# EAGLE design BackPlane (EAGLE 7.4.0)
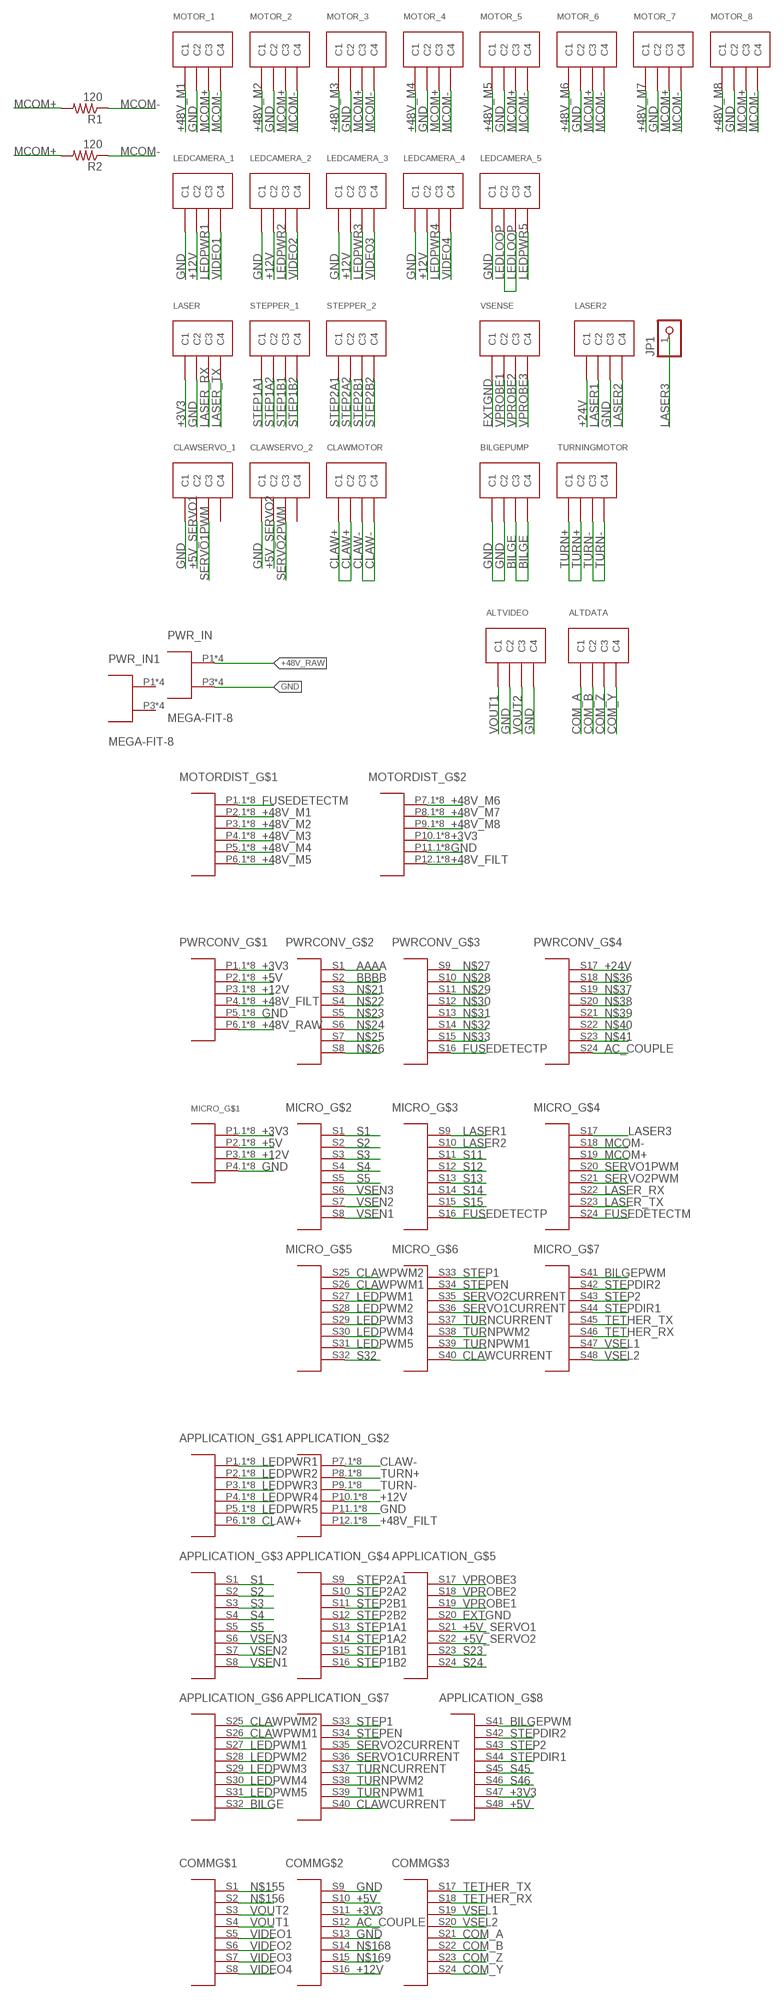
[diagram p0: schematic, sheet 1]

## Parts
ALTDATA  MICRO-FIT-4-SMD-PART  [MIRCO-FIT-4-SMD]
ALTVIDEO  MICRO-FIT-4-SMD-PART  [MIRCO-FIT-4-SMD]
APPLICATION_  TEN60-P6-S24-S24-P6-VERT  [TEN60-P6-S24-S24-P6-VERT]
BILGEPUMP  MICRO-FIT-4-SMD-PART  [MIRCO-FIT-4-SMD]
CLAWMOTOR  MICRO-FIT-4-SMD-PART  [MIRCO-FIT-4-SMD]
CLAWSERVO_1  MICRO-FIT-4-SMD-PART  [MIRCO-FIT-4-SMD]
CLAWSERVO_2  MICRO-FIT-4-SMD-PART  [MIRCO-FIT-4-SMD]
COMM  TEN60-S24-RA  [TEN60-S24-RA]
JP1  PINHD-1X1  [1X01]
LASER  MICRO-FIT-4-SMD-PART  [MIRCO-FIT-4-SMD]
LASER2  MICRO-FIT-4-SMD-PART  [MIRCO-FIT-4-SMD]
LEDCAMERA_1  MICRO-FIT-4-SMD-PART  [MIRCO-FIT-4-SMD]
LEDCAMERA_2  MICRO-FIT-4-SMD-PART  [MIRCO-FIT-4-SMD]
LEDCAMERA_3  MICRO-FIT-4-SMD-PART  [MIRCO-FIT-4-SMD]
LEDCAMERA_4  MICRO-FIT-4-SMD-PART  [MIRCO-FIT-4-SMD]
LEDCAMERA_5  MICRO-FIT-4-SMD-PART  [MIRCO-FIT-4-SMD]
MICRO_  TEN60-S24-S24-P4-VERT  [TEN60-S24-S24-P4-VERT]
MOTOR_1  MICRO-FIT-4-SMD-PART  [MIRCO-FIT-4-SMD]
MOTOR_2  MICRO-FIT-4-SMD-PART  [MIRCO-FIT-4-SMD]
MOTOR_3  MICRO-FIT-4-SMD-PART  [MIRCO-FIT-4-SMD]
MOTOR_4  MICRO-FIT-4-SMD-PART  [MIRCO-FIT-4-SMD]
MOTOR_5  MICRO-FIT-4-SMD-PART  [MIRCO-FIT-4-SMD]
MOTOR_6  MICRO-FIT-4-SMD-PART  [MIRCO-FIT-4-SMD]
MOTOR_7  MICRO-FIT-4-SMD-PART  [MIRCO-FIT-4-SMD]
MOTOR_8  MICRO-FIT-4-SMD-PART  [MIRCO-FIT-4-SMD]
MOTORDIST_  TEN60-P6-P6-VERT  [TEN60-P6-P6-VERT]
PWR_IN  MEGA-FIT-8  [MEGA-FIT-8]
PWR_IN1  MEGA-FIT-8  [MEGA-FIT-8]
PWRCONV_  TEN60-S24-P6-VERT  [TEN60-S24-P6-VERT]
R1  120  R-US_R0603  [R0603]
R2  120  R-US_R0603  [R0603]
STEPPER_1  MICRO-FIT-4-SMD-PART  [MIRCO-FIT-4-SMD]
STEPPER_2  MICRO-FIT-4-SMD-PART  [MIRCO-FIT-4-SMD]
TURNINGMOTOR  MICRO-FIT-4-SMD-PART  [MIRCO-FIT-4-SMD]
VSENSE  MICRO-FIT-4-SMD-PART  [MIRCO-FIT-4-SMD]

## Nets
+3V3: APPLICATION_.S47 COMM.S11 LASER.C1 MICRO_.P1.1 MICRO_.P1.2 MICRO_.P1.3 MICRO_.P1.4 MICRO_.P1.5 MICRO_.P1.6 MICRO_.P1.7 MICRO_.P1.8 MOTORDIST_.P10.1 MOTORDIST_.P10.2 MOTORDIST_.P10.3 MOTORDIST_.P10.4 MOTORDIST_.P10.5 MOTORDIST_.P10.6 MOTORDIST_.P10.7 MOTORDIST_.P10.8 PWRCONV_.P1.1 PWRCONV_.P1.2 PWRCONV_.P1.3 PWRCONV_.P1.4 PWRCONV_.P1.5 PWRCONV_.P1.6 PWRCONV_.P1.7 PWRCONV_.P1.8
+5V: APPLICATION_.S48 COMM.S10 MICRO_.P2.1 MICRO_.P2.2 MICRO_.P2.3 MICRO_.P2.4 MICRO_.P2.5 MICRO_.P2.6 MICRO_.P2.7 MICRO_.P2.8 PWRCONV_.P2.1 PWRCONV_.P2.2 PWRCONV_.P2.3 PWRCONV_.P2.4 PWRCONV_.P2.5 PWRCONV_.P2.6 PWRCONV_.P2.7 PWRCONV_.P2.8
+5V_SERVO1: APPLICATION_.S21 CLAWSERVO_1.C2
+5V_SERVO2: APPLICATION_.S22 CLAWSERVO_2.C2
+12V: APPLICATION_.P10.1 APPLICATION_.P10.2 APPLICATION_.P10.3 APPLICATION_.P10.4 APPLICATION_.P10.5 APPLICATION_.P10.6 APPLICATION_.P10.7 APPLICATION_.P10.8 COMM.S16 LEDCAMERA_1.C2 LEDCAMERA_2.C2 LEDCAMERA_3.C2 LEDCAMERA_4.C2 MICRO_.P3.1 MICRO_.P3.2 MICRO_.P3.3 MICRO_.P3.4 MICRO_.P3.5 MICRO_.P3.6 MICRO_.P3.7 MICRO_.P3.8 PWRCONV_.P3.1 PWRCONV_.P3.2 PWRCONV_.P3.3 PWRCONV_.P3.4 PWRCONV_.P3.5 PWRCONV_.P3.6 PWRCONV_.P3.7 PWRCONV_.P3.8
+24V: LASER2.C1 PWRCONV_.S17
+48V_FILT: APPLICATION_.P12.1 APPLICATION_.P12.2 APPLICATION_.P12.3 APPLICATION_.P12.4 APPLICATION_.P12.5 APPLICATION_.P12.6 APPLICATION_.P12.7 APPLICATION_.P12.8 MOTORDIST_.P12.1 MOTORDIST_.P12.2 MOTORDIST_.P12.3 MOTORDIST_.P12.4 MOTORDIST_.P12.5 MOTORDIST_.P12.6 MOTORDIST_.P12.7 MOTORDIST_.P12.8 PWRCONV_.P4.1 PWRCONV_.P4.2 PWRCONV_.P4.3 PWRCONV_.P4.4 PWRCONV_.P4.5 PWRCONV_.P4.6 PWRCONV_.P4.7 PWRCONV_.P4.8
+48V_M1: MOTOR_1.C1 MOTORDIST_.P2.1 MOTORDIST_.P2.2 MOTORDIST_.P2.3 MOTORDIST_.P2.4 MOTORDIST_.P2.5 MOTORDIST_.P2.6 MOTORDIST_.P2.7 MOTORDIST_.P2.8
+48V_M2: MOTOR_2.C1 MOTORDIST_.P3.1 MOTORDIST_.P3.2 MOTORDIST_.P3.3 MOTORDIST_.P3.4 MOTORDIST_.P3.5 MOTORDIST_.P3.6 MOTORDIST_.P3.7 MOTORDIST_.P3.8
+48V_M3: MOTOR_3.C1 MOTORDIST_.P4.1 MOTORDIST_.P4.2 MOTORDIST_.P4.3 MOTORDIST_.P4.4 MOTORDIST_.P4.5 MOTORDIST_.P4.6 MOTORDIST_.P4.7 MOTORDIST_.P4.8
+48V_M4: MOTOR_4.C1 MOTORDIST_.P5.1 MOTORDIST_.P5.2 MOTORDIST_.P5.3 MOTORDIST_.P5.4 MOTORDIST_.P5.5 MOTORDIST_.P5.6 MOTORDIST_.P5.7 MOTORDIST_.P5.8
+48V_M5: MOTOR_5.C1 MOTORDIST_.P6.1 MOTORDIST_.P6.2 MOTORDIST_.P6.3 MOTORDIST_.P6.4 MOTORDIST_.P6.5 MOTORDIST_.P6.6 MOTORDIST_.P6.7 MOTORDIST_.P6.8
+48V_M6: MOTOR_6.C1 MOTORDIST_.P7.1 MOTORDIST_.P7.2 MOTORDIST_.P7.3 MOTORDIST_.P7.4 MOTORDIST_.P7.5 MOTORDIST_.P7.6 MOTORDIST_.P7.7 MOTORDIST_.P7.8
+48V_M7: MOTOR_7.C1 MOTORDIST_.P8.1 MOTORDIST_.P8.2 MOTORDIST_.P8.3 MOTORDIST_.P8.4 MOTORDIST_.P8.5 MOTORDIST_.P8.6 MOTORDIST_.P8.7 MOTORDIST_.P8.8
+48V_M8: MOTOR_8.C1 MOTORDIST_.P9.1 MOTORDIST_.P9.2 MOTORDIST_.P9.3 MOTORDIST_.P9.4 MOTORDIST_.P9.5 MOTORDIST_.P9.6 MOTORDIST_.P9.7 MOTORDIST_.P9.8
+48V_RAW: PWR_IN.P1 PWR_IN.P2 PWR_IN.P5 PWR_IN.P6 PWRCONV_.P6.1 PWRCONV_.P6.2 PWRCONV_.P6.3 PWRCONV_.P6.4 PWRCONV_.P6.5 PWRCONV_.P6.6 PWRCONV_.P6.7 PWRCONV_.P6.8
AAAA: PWRCONV_.S1
AC_COUPLE: COMM.S12 PWRCONV_.S24
BBBB: PWRCONV_.S2
BILGE: APPLICATION_.S32 BILGEPUMP.C3 BILGEPUMP.C4
BILGEPWM: APPLICATION_.S41 MICRO_.S41
CLAW+: APPLICATION_.P6.1 APPLICATION_.P6.2 APPLICATION_.P6.3 APPLICATION_.P6.4 APPLICATION_.P6.5 APPLICATION_.P6.6 APPLICATION_.P6.7 APPLICATION_.P6.8 CLAWMOTOR.C1 CLAWMOTOR.C2
CLAW-: APPLICATION_.P7.1 APPLICATION_.P7.2 APPLICATION_.P7.3 APPLICATION_.P7.4 APPLICATION_.P7.5 APPLICATION_.P7.6 APPLICATION_.P7.7 APPLICATION_.P7.8 CLAWMOTOR.C3 CLAWMOTOR.C4
CLAWCURRENT: APPLICATION_.S40 MICRO_.S40
CLAWPWM1: APPLICATION_.S26 MICRO_.S26
CLAWPWM2: APPLICATION_.S25 MICRO_.S25
COM_A: ALTDATA.C1 COMM.S21
COM_B: ALTDATA.C2 COMM.S22
COM_Y: ALTDATA.C4 COMM.S24
COM_Z: ALTDATA.C3 COMM.S23
EXTGND: APPLICATION_.S20 VSENSE.C1
FUSEDETECTM: MICRO_.S24 MOTORDIST_.P1.1 MOTORDIST_.P1.2 MOTORDIST_.P1.3 MOTORDIST_.P1.4 MOTORDIST_.P1.5 MOTORDIST_.P1.6 MOTORDIST_.P1.7 MOTORDIST_.P1.8
FUSEDETECTP: MICRO_.S16 PWRCONV_.S16
GND: ALTVIDEO.C2 ALTVIDEO.C4 APPLICATION_.P11.1 APPLICATION_.P11.2 APPLICATION_.P11.3 APPLICATION_.P11.4 APPLICATION_.P11.5 APPLICATION_.P11.6 APPLICATION_.P11.7 APPLICATION_.P11.8 BILGEPUMP.C1 BILGEPUMP.C2 CLAWSERVO_1.C1 CLAWSERVO_2.C1 COMM.S9 COMM.S13 LASER2.C3 LASER.C2 LEDCAMERA_1.C1 LEDCAMERA_2.C1 LEDCAMERA_3.C1 LEDCAMERA_4.C1 LEDCAMERA_5.C1 MICRO_.P4.1 MICRO_.P4.2 MICRO_.P4.3 MICRO_.P4.4 MICRO_.P4.5 MICRO_.P4.6 MICRO_.P4.7 MICRO_.P4.8 MOTOR_1.C2 MOTOR_2.C2 MOTOR_3.C2 MOTOR_4.C2 MOTOR_5.C2 MOTOR_6.C2 MOTOR_7.C2 MOTOR_8.C2 MOTORDIST_.P11.1 MOTORDIST_.P11.2 MOTORDIST_.P11.3 MOTORDIST_.P11.4 MOTORDIST_.P11.5 MOTORDIST_.P11.6 MOTORDIST_.P11.7 MOTORDIST_.P11.8 PWR_IN.P3 PWR_IN.P4 PWR_IN.P7 PWR_IN.P8 PWRCONV_.P5.1 PWRCONV_.P5.2 PWRCONV_.P5.3 PWRCONV_.P5.4 PWRCONV_.P5.5 PWRCONV_.P5.6 PWRCONV_.P5.7 PWRCONV_.P5.8
LASER1: LASER2.C2 MICRO_.S9
LASER2: LASER2.C4 MICRO_.S10
LASER3: JP1.1 MICRO_.S17
LASER_RX: LASER.C3 MICRO_.S22
LASER_TX: LASER.C4 MICRO_.S23
LEDLOOP: LEDCAMERA_5.C2 LEDCAMERA_5.C3
LEDPWM1: APPLICATION_.S27 MICRO_.S27
LEDPWM2: APPLICATION_.S28 MICRO_.S28
LEDPWM3: APPLICATION_.S29 MICRO_.S29
LEDPWM4: APPLICATION_.S30 MICRO_.S30
LEDPWM5: APPLICATION_.S31 MICRO_.S31
LEDPWR1: APPLICATION_.P1.1 APPLICATION_.P1.2 APPLICATION_.P1.3 APPLICATION_.P1.4 APPLICATION_.P1.5 APPLICATION_.P1.6 APPLICATION_.P1.7 APPLICATION_.P1.8 LEDCAMERA_1.C3
LEDPWR2: APPLICATION_.P2.1 APPLICATION_.P2.2 APPLICATION_.P2.3 APPLICATION_.P2.4 APPLICATION_.P2.5 APPLICATION_.P2.6 APPLICATION_.P2.7 APPLICATION_.P2.8 LEDCAMERA_2.C3
LEDPWR3: APPLICATION_.P3.1 APPLICATION_.P3.2 APPLICATION_.P3.3 APPLICATION_.P3.4 APPLICATION_.P3.5 APPLICATION_.P3.6 APPLICATION_.P3.7 APPLICATION_.P3.8 LEDCAMERA_3.C3
LEDPWR4: APPLICATION_.P4.1 APPLICATION_.P4.2 APPLICATION_.P4.3 APPLICATION_.P4.4 APPLICATION_.P4.5 APPLICATION_.P4.6 APPLICATION_.P4.7 APPLICATION_.P4.8 LEDCAMERA_4.C3
LEDPWR5: APPLICATION_.P5.1 APPLICATION_.P5.2 APPLICATION_.P5.3 APPLICATION_.P5.4 APPLICATION_.P5.5 APPLICATION_.P5.6 APPLICATION_.P5.7 APPLICATION_.P5.8 LEDCAMERA_5.C4
MCOM+: MICRO_.S19 MOTOR_1.C3 MOTOR_2.C3 MOTOR_3.C3 MOTOR_4.C3 MOTOR_5.C3 MOTOR_6.C3 MOTOR_7.C3 MOTOR_8.C3 R1.2 R2.2
MCOM-: MICRO_.S18 MOTOR_1.C4 MOTOR_2.C4 MOTOR_3.C4 MOTOR_4.C4 MOTOR_5.C4 MOTOR_6.C4 MOTOR_7.C4 MOTOR_8.C4 R1.1 R2.1
N$21: PWRCONV_.S3
N$22: PWRCONV_.S4
N$23: PWRCONV_.S5
N$24: PWRCONV_.S6
N$25: PWRCONV_.S7
N$26: PWRCONV_.S8
N$27: PWRCONV_.S9
N$28: PWRCONV_.S10
N$29: PWRCONV_.S11
N$30: PWRCONV_.S12
N$31: PWRCONV_.S13
N$32: PWRCONV_.S14
N$33: PWRCONV_.S15
N$36: PWRCONV_.S18
N$37: PWRCONV_.S19
N$38: PWRCONV_.S20
N$39: PWRCONV_.S21
N$40: PWRCONV_.S22
N$41: PWRCONV_.S23
N$155: COMM.S1
N$156: COMM.S2
N$168: COMM.S14
N$169: COMM.S15
S1: APPLICATION_.S1 MICRO_.S1
S2: APPLICATION_.S2 MICRO_.S2
S3: APPLICATION_.S3 MICRO_.S3
S4: APPLICATION_.S4 MICRO_.S4
S5: APPLICATION_.S5 MICRO_.S5
S11: MICRO_.S11
S12: MICRO_.S12
S13: MICRO_.S13
S14: MICRO_.S14
S15: MICRO_.S15
S23: APPLICATION_.S23
S24: APPLICATION_.S24
S32: MICRO_.S32
S45: APPLICATION_.S45
S46: APPLICATION_.S46
SERVO1CURRENT: APPLICATION_.S36 MICRO_.S36
SERVO1PWM: CLAWSERVO_1.C3 MICRO_.S20
SERVO2CURRENT: APPLICATION_.S35 MICRO_.S35
SERVO2PWM: CLAWSERVO_2.C3 MICRO_.S21
STEP1: APPLICATION_.S33 MICRO_.S33
STEP1A1: APPLICATION_.S13 STEPPER_1.C1
STEP1A2: APPLICATION_.S14 STEPPER_1.C2
STEP1B1: APPLICATION_.S15 STEPPER_1.C3
STEP1B2: APPLICATION_.S16 STEPPER_1.C4
STEP2: APPLICATION_.S43 MICRO_.S43
STEP2A1: APPLICATION_.S9 STEPPER_2.C1
STEP2A2: APPLICATION_.S10 STEPPER_2.C2
STEP2B1: APPLICATION_.S11 STEPPER_2.C3
STEP2B2: APPLICATION_.S12 STEPPER_2.C4
STEPDIR1: APPLICATION_.S44 MICRO_.S44
STEPDIR2: APPLICATION_.S42 MICRO_.S42
STEPEN: APPLICATION_.S34 MICRO_.S34
TETHER_RX: COMM.S18 MICRO_.S46
TETHER_TX: COMM.S17 MICRO_.S45
TURN+: APPLICATION_.P8.1 APPLICATION_.P8.2 APPLICATION_.P8.3 APPLICATION_.P8.4 APPLICATION_.P8.5 APPLICATION_.P8.6 APPLICATION_.P8.7 APPLICATION_.P8.8 TURNINGMOTOR.C1 TURNINGMOTOR.C2
TURN-: APPLICATION_.P9.1 APPLICATION_.P9.2 APPLICATION_.P9.3 APPLICATION_.P9.4 APPLICATION_.P9.5 APPLICATION_.P9.6 APPLICATION_.P9.7 APPLICATION_.P9.8 TURNINGMOTOR.C3 TURNINGMOTOR.C4
TURNCURRENT: APPLICATION_.S37 MICRO_.S37
TURNPWM1: APPLICATION_.S39 MICRO_.S39
TURNPWM2: APPLICATION_.S38 MICRO_.S38
VIDEO1: COMM.S5 LEDCAMERA_1.C4
VIDEO2: COMM.S6 LEDCAMERA_2.C4
VIDEO3: COMM.S7 LEDCAMERA_3.C4
VIDEO4: COMM.S8 LEDCAMERA_4.C4
VOUT1: ALTVIDEO.C1 COMM.S4
VOUT2: ALTVIDEO.C3 COMM.S3
VPROBE1: APPLICATION_.S19 VSENSE.C2
VPROBE2: APPLICATION_.S18 VSENSE.C3
VPROBE3: APPLICATION_.S17 VSENSE.C4
VSEL1: COMM.S19 MICRO_.S47
VSEL2: COMM.S20 MICRO_.S48
VSEN1: APPLICATION_.S8 MICRO_.S8
VSEN2: APPLICATION_.S7 MICRO_.S7
VSEN3: APPLICATION_.S6 MICRO_.S6
Unconnected: CLAWSERVO_1.C4 CLAWSERVO_2.C4 PWR_IN1.P1 PWR_IN1.P2 PWR_IN1.P3 PWR_IN1.P4 PWR_IN1.P5 PWR_IN1.P6 PWR_IN1.P7 PWR_IN1.P8

## Library data of the parts
ALTDATA ALTVIDEO BILGEPUMP CLAWMOTOR CLAWSERVO_1 CLAWSERVO_2 LASER LASER2 LEDCAMERA_1-LEDCAMERA_5 MOTOR_1-MOTOR_8 STEPPER_1 STEPPER_2 TURNINGMOTOR VSENSE = MolexCustom:MICRO-FIT-4-SMD: 4 Pin Molex connector; DIGIKEY-CONTACT-PN: WM1125CT-ND; DIGIKEY-FEMALE-PN: WM2640CT-ND; DIGIKEY-MALE-PN: WM1847-ND
APPLICATION_ = BackplaneConnector:TEN60-P6-S24-S24-P6-VERT
COMM = BackplaneConnector:TEN60-S24-RA
JP1 = pinhead:PINHD-1X1: PIN HEADER
MICRO_ = BackplaneConnector:TEN60-S24-S24-P4-VERT
MOTORDIST_ = BackplaneConnector:TEN60-P6-P6-VERT
PWR_IN PWR_IN1 = BackplaneConnector:MEGA-FIT-8
PWRCONV_ = BackplaneConnector:TEN60-S24-P6-VERT
R1 R2 = rcl:R-US_: RESISTOR, American symbol

## Board
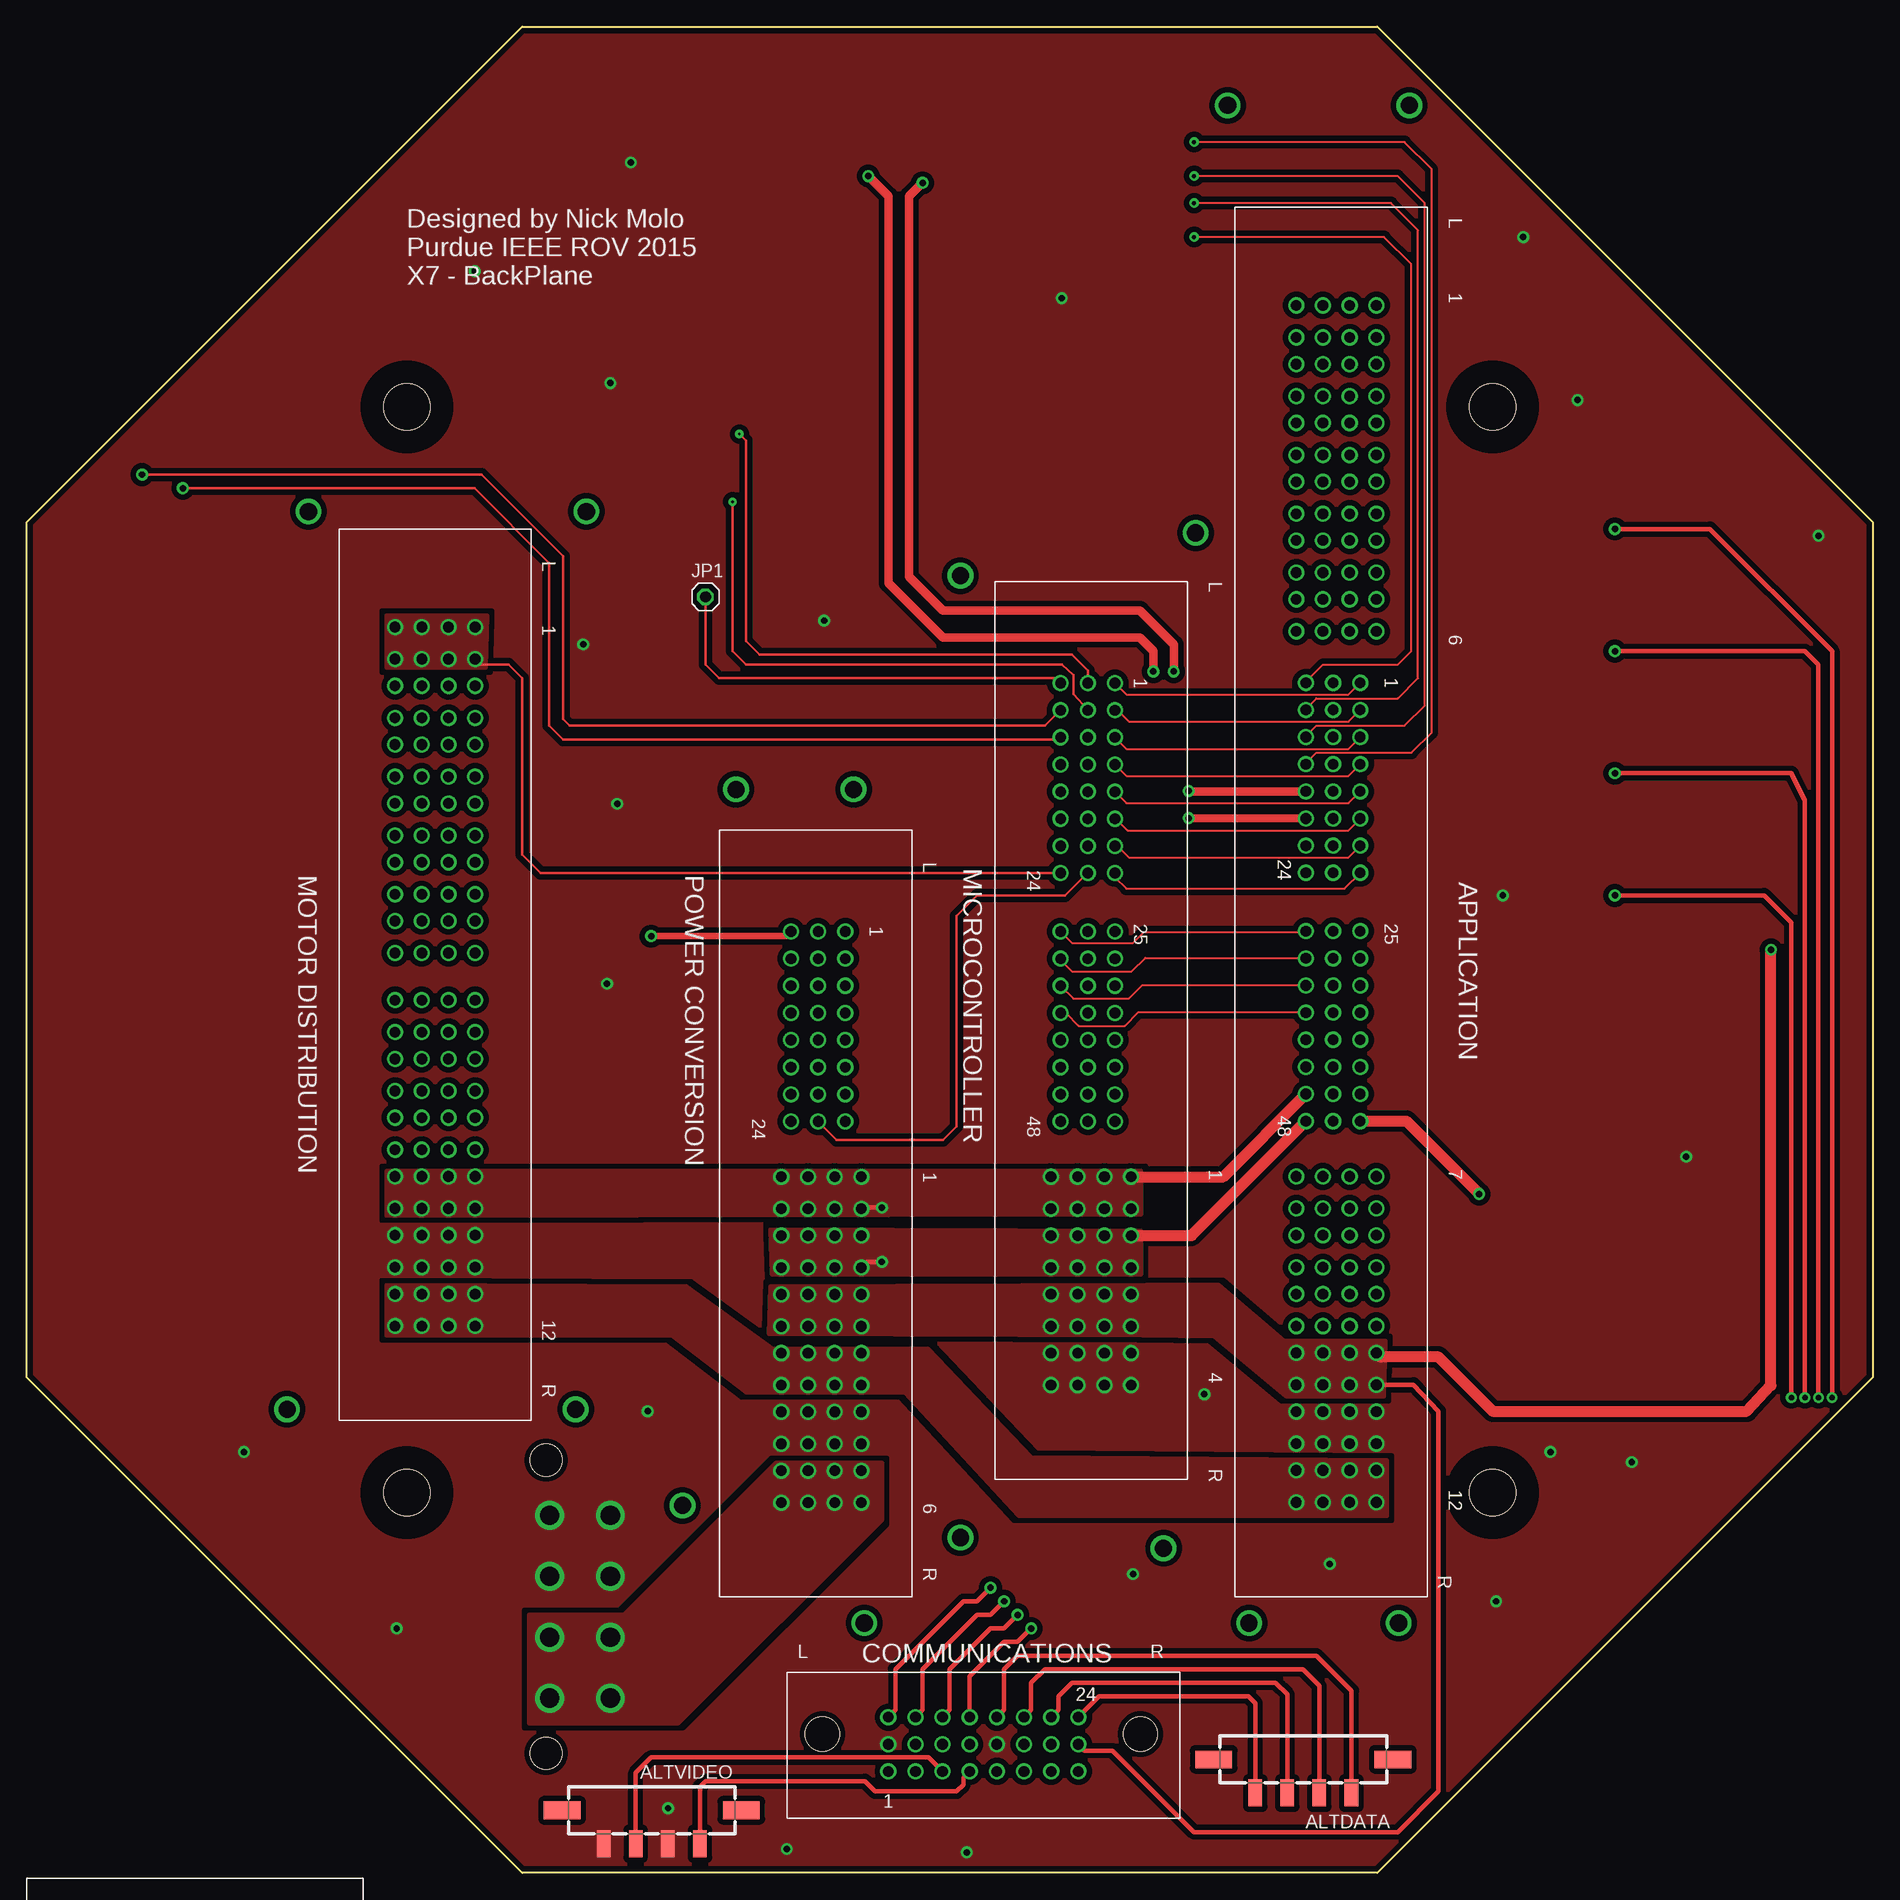
[diagram p1: board, top side]
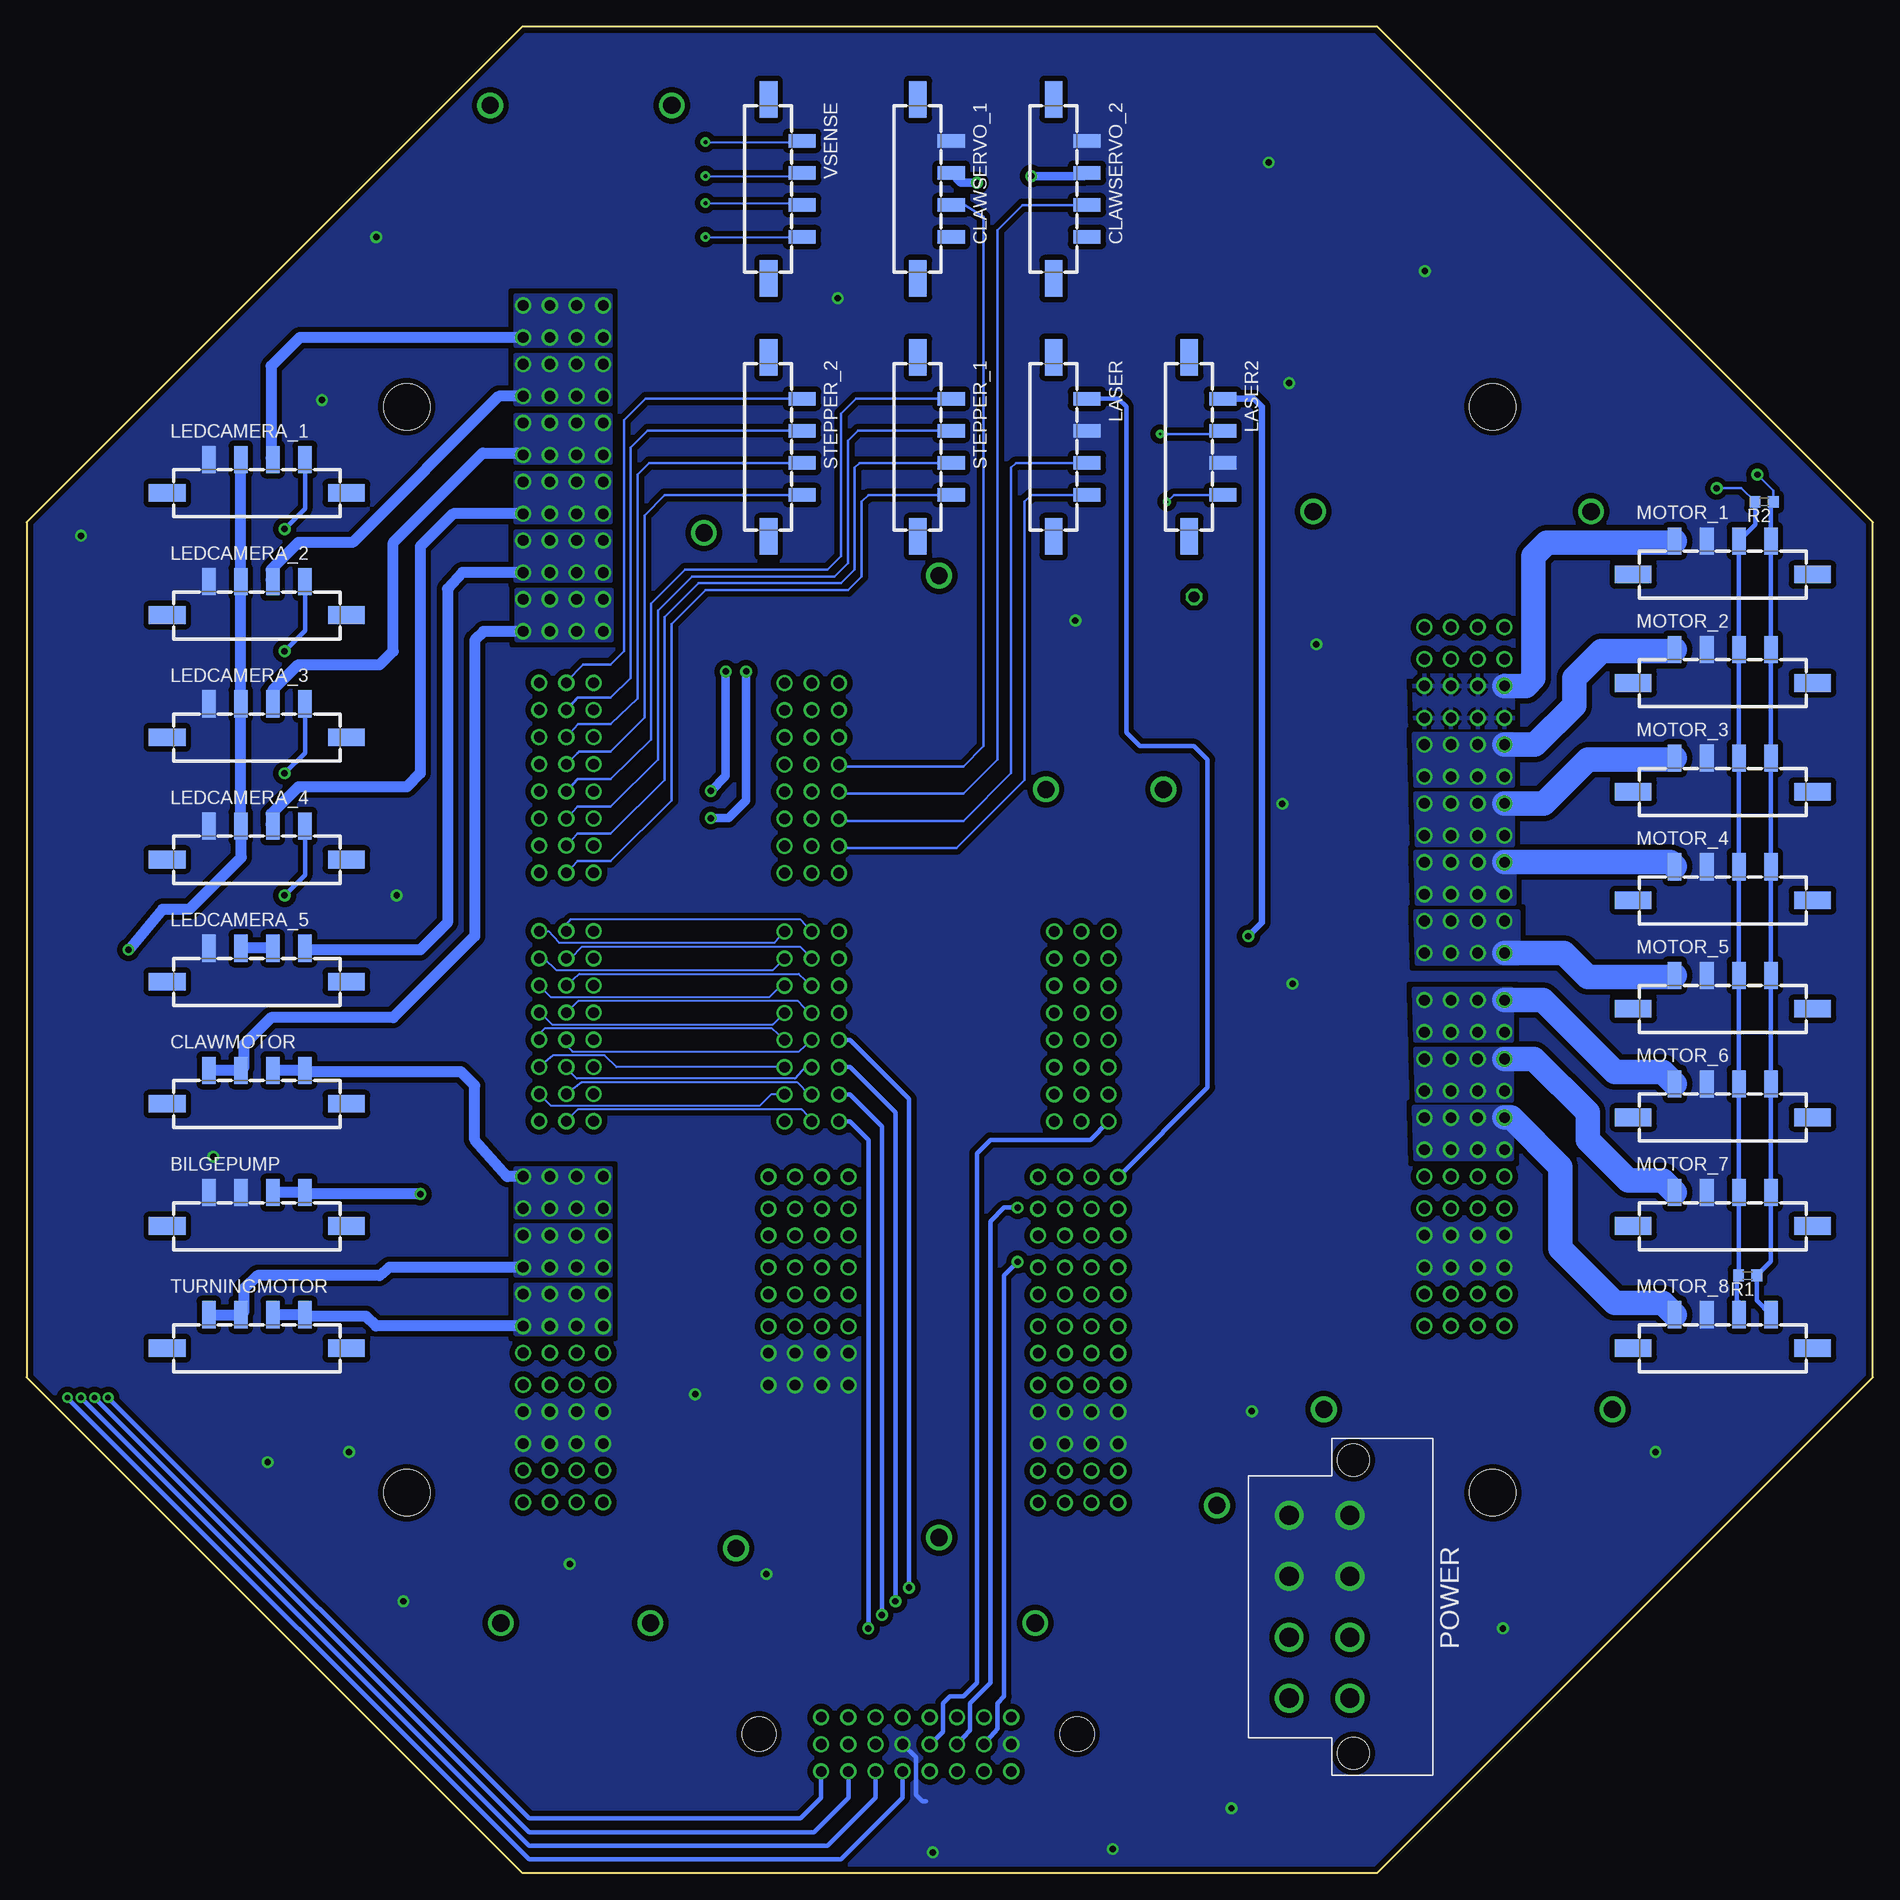
[diagram p2: board, bottom side, seen from below]

Size 172.72 x 172.72 mm. Coordinates in mm from the lower left corner, seen from the top.
Outline: 172.72,126.36 172.72,46.36 126.36,0 46.36,0 0,46.36 0,126.36 46.36,172.72 126.36,172.72 172.72,126.36
Copper layers (1*16): Top 0.035mm / dielectric 1.5mm / Bottom 0.035mm
Design rules "default": minimum track width 7mil, minimum drill 10mil, track to track 7mil, track to pad 7mil, pad to pad 7mil, via to via 7mil, smd to smd 7mil, copper to edge 10mil, drill to drill 8mil, minimum pad ring 10mil, minimum via ring 10mil, stop-mask expansion 4mil, vias tented up to drill 25mil, thermal gap 10mil
Holes 4.32 mm at 35.56,35.56 137.16,35.56 137.16,137.16 35.56,137.16
tRestrict: area 35.6,137.2 to 35.6,137.2; area 35.6,35.6 to 35.6,35.6; area 137.2,35.6 to 137.2,35.6; area 137.2,137.2 to 137.2,137.2

### Footprints (pad centres in the part's own frame; a part is rotated, then mirrored left to right if it is on the bottom)
MIRCO-FIT-4-SMD = smd 1.27 x 2.54: C1 5.6,3.955; C2 8.6,3.955; C3 11.6,3.955; C4 14.6,3.955 | smd 3.43 x 1.65: NC1 1.715,0.825; NC2 18.485,0.825
TEN60-P6-S24-S24-P6-VERT = drill 1: P1.1 9.18,13.25; P1.2 9.18,10.75; P1.3 9.18,8.25; P1.4 9.18,5.75; P1.5 12.18,5.75; P1.6 12.18,8.25; P1.7 12.18,10.75; P1.8 12.18,13.25; P2.1 14.68,13.25; P2.2 14.68,10.75; P2.3 14.68,8.25; P2.4 14.68,5.75; P2.5 17.68,5.75; P2.6 17.68,8.25; P2.7 17.68,10.75; P2.8 17.68,13.25; P3.1 20.18,13.25; P3.2 20.18,10.75; P3.3 20.18,8.25; P3.4 20.18,5.75; P3.5 23.18,5.75; P3.6 23.18,8.25; P3.7 23.18,10.75; P3.8 23.18,13.25; P4.1 25.68,13.25; P4.2 25.68,10.75; P4.3 25.68,8.25; P4.4 25.68,5.75; P4.5 28.68,5.75; P4.6 28.68,8.25; P4.7 28.68,10.75; P4.8 28.68,13.25; P5.1 31.18,13.25; P5.2 31.18,10.75; P5.3 31.18,8.25; P5.4 31.18,5.75; P5.5 34.18,5.75; P5.6 34.18,8.25; P5.7 34.18,10.75; P5.8 34.18,13.25; P6.1 36.68,13.25; P6.2 36.68,10.75; P6.3 36.68,8.25; P6.4 36.68,5.75; P6.5 39.68,5.75; P6.6 39.68,8.25; P6.7 39.68,10.75; P6.8 39.68,13.25; P7.1 90.68,13.25; P7.2 90.68,10.75; P7.3 90.68,8.25; P7.4 90.68,5.75; P7.5 93.68,5.75; P7.6 93.68,8.25; P7.7 93.68,10.75; P7.8 93.68,13.25; P8.1 96.18,13.25; P8.2 96.18,10.75; P8.3 96.18,8.25; P8.4 96.18,5.75; P8.5 99.18,5.75; P8.6 99.18,8.25; P8.7 99.18,10.75; P8.8 99.18,13.25; P9.1 101.68,13.25; P9.2 101.68,10.75; P9.3 101.68,8.25; P9.4 101.68,5.75; P9.5 104.68,5.75; P9.6 104.68,8.25; P9.7 104.68,10.75; P9.8 104.68,13.25; P10.1 107.18,13.25; P10.2 107.18,10.75; P10.3 107.18,8.25; P10.4 107.18,5.75; P10.5 110.18,5.75; P10.6 110.18,8.25; P10.7 110.18,10.75; P10.8 110.18,13.25; P11.1 112.68,13.25; P11.2 112.68,10.75; P11.3 112.68,8.25; P11.4 112.68,5.75; P11.5 115.68,5.75; P11.6 115.68,8.25; P11.7 115.68,10.75; P11.8 115.68,13.25; P12.1 118.18,13.25; P12.2 118.18,10.75; P12.3 118.18,8.25; P12.4 118.18,5.75; P12.5 121.18,5.75; P12.6 121.18,8.25; P12.7 121.18,10.75; P12.8 121.18,13.25; S1 44.49,11.74; S2 47.03,11.74; S3 49.57,11.74; S4 52.11,11.74; S5 54.65,11.74; S6 57.19,11.74; S7 59.73,11.74; S8 62.27,11.74; S9 44.49,9.2; S10 47.03,9.2; S11 49.57,9.2; S12 52.11,9.2; S13 54.65,9.2; S14 57.19,9.2; S15 59.73,9.2; S16 62.27,9.2; S17 44.49,6.66; S18 47.03,6.66; S19 49.57,6.66; S20 52.11,6.66; S21 54.65,6.66; S22 57.19,6.66; S23 59.73,6.66; S24 62.27,6.66; S25 67.73,11.74; S26 70.27,11.74; S27 72.81,11.74; S28 75.35,11.74; S29 77.89,11.74; S30 80.43,11.74; S31 82.97,11.74; S32 85.51,11.74; S33 67.73,9.2; S34 70.27,9.2; S35 72.81,9.2; S36 75.35,9.2; S37 77.89,9.2; S38 80.43,9.2; S39 82.97,9.2; S40 85.51,9.2; S41 67.73,6.66; S42 70.27,6.66; S43 72.81,6.66; S44 75.35,6.66; S45 77.89,6.66; S46 80.43,6.66; S47 82.97,6.66; S48 85.51,6.66
TEN60-S24-RA = drill 1: S1 9.49,4.4; S2 12.03,4.4; S3 14.57,4.4; S4 17.11,4.4; S5 19.65,4.4; S6 22.19,4.4; S7 24.73,4.4; S8 27.27,4.4; S9 9.49,6.94; S10 12.03,6.94; S11 14.57,6.94; S12 17.11,6.94; S13 19.65,6.94; S14 22.19,6.94; S15 24.73,6.94; S16 27.27,6.94; S17 9.49,9.48; S18 12.03,9.48; S19 14.57,9.48; S20 17.11,9.48; S21 19.65,9.48; S22 22.19,9.48; S23 24.73,9.48; S24 27.27,9.48 | hole 3.2: 3.32,7.9; 33.08,7.9
1X01 = drill 1.016 octagon: 1 0,0
TEN60-S24-S24-P4-VERT = drill 1: P1.1 55.68,12.75; P1.2 55.68,10.25; P1.3 55.68,7.75; P1.4 55.68,5.25; P1.5 58.68,5.25; P1.6 58.68,7.75; P1.7 58.68,10.25; P1.8 58.68,12.75; P2.1 61.18,12.75; P2.2 61.18,10.25; P2.3 61.18,7.75; P2.4 61.18,5.25; P2.5 64.18,5.25; P2.6 64.18,7.75; P2.7 64.18,10.25; P2.8 64.18,12.75; P3.1 66.68,12.75; P3.2 66.68,10.25; P3.3 66.68,7.75; P3.4 66.68,5.25; P3.5 69.68,5.25; P3.6 69.68,7.75; P3.7 69.68,10.25; P3.8 69.68,12.75; P4.1 72.18,12.75; P4.2 72.18,10.25; P4.3 72.18,7.75; P4.4 72.18,5.25; P4.5 75.18,5.25; P4.6 75.18,7.75; P4.7 75.18,10.25; P4.8 75.18,12.75; S1 9.49,11.24; S2 12.03,11.24; S3 14.57,11.24; S4 17.11,11.24; S5 19.65,11.24; S6 22.19,11.24; S7 24.73,11.24; S8 27.27,11.24; S9 9.49,8.7; S10 12.03,8.7; S11 14.57,8.7; S12 17.11,8.7; S13 19.65,8.7; S14 22.19,8.7; S15 24.73,8.7; S16 27.27,8.7; S17 9.49,6.16; S18 12.03,6.16; S19 14.57,6.16; S20 17.11,6.16; S21 19.65,6.16; S22 22.19,6.16; S23 24.73,6.16; S24 27.27,6.16; S25 32.73,11.24; S26 35.27,11.24; S27 37.81,11.24; S28 40.35,11.24; S29 42.89,11.24; S30 45.43,11.24; S31 47.97,11.24; S32 50.51,11.24; S33 32.73,8.7; S34 35.27,8.7; S35 37.81,8.7; S36 40.35,8.7; S37 42.89,8.7; S38 45.43,8.7; S39 47.97,8.7; S40 50.51,8.7; S41 32.73,6.16; S42 35.27,6.16; S43 37.81,6.16; S44 40.35,6.16; S45 42.89,6.16; S46 45.43,6.16; S47 47.97,6.16; S48 50.51,6.16
TEN60-P6-P6-VERT = drill 1: P1.1 9.18,12.75; P1.2 9.18,10.25; P1.3 9.18,7.75; P1.4 9.18,5.25; P1.5 12.18,5.25; P1.6 12.18,7.75; P1.7 12.18,10.25; P1.8 12.18,12.75; P2.1 14.68,12.75; P2.2 14.68,10.25; P2.3 14.68,7.75; P2.4 14.68,5.25; P2.5 17.68,5.25; P2.6 17.68,7.75; P2.7 17.68,10.25; P2.8 17.68,12.75; P3.1 20.18,12.75; P3.2 20.18,10.25; P3.3 20.18,7.75; P3.4 20.18,5.25; P3.5 23.18,5.25; P3.6 23.18,7.75; P3.7 23.18,10.25; P3.8 23.18,12.75; P4.1 25.68,12.75; P4.2 25.68,10.25; P4.3 25.68,7.75; P4.4 25.68,5.25; P4.5 28.68,5.25; P4.6 28.68,7.75; P4.7 28.68,10.25; P4.8 28.68,12.75; P5.1 31.18,12.75; P5.2 31.18,10.25; P5.3 31.18,7.75; P5.4 31.18,5.25; P5.5 34.18,5.25; P5.6 34.18,7.75; P5.7 34.18,10.25; P5.8 34.18,12.75; P6.1 36.68,12.75; P6.2 36.68,10.25; P6.3 36.68,7.75; P6.4 36.68,5.25; P6.5 39.68,5.25; P6.6 39.68,7.75; P6.7 39.68,10.25; P6.8 39.68,12.75; P7.1 44.08,12.75; P7.2 44.08,10.25; P7.3 44.08,7.75; P7.4 44.08,5.25; P7.5 47.08,5.25; P7.6 47.08,7.75; P7.7 47.08,10.25; P7.8 47.08,12.75; P8.1 49.58,12.75; P8.2 49.58,10.25; P8.3 49.58,7.75; P8.4 49.58,5.25; P8.5 52.58,5.25; P8.6 52.58,7.75; P8.7 52.58,10.25; P8.8 52.58,12.75; P9.1 55.08,12.75; P9.2 55.08,10.25; P9.3 55.08,7.75; P9.4 55.08,5.25; P9.5 58.08,5.25; P9.6 58.08,7.75; P9.7 58.08,10.25; P9.8 58.08,12.75; P10.1 60.58,12.75; P10.2 60.58,10.25; P10.3 60.58,7.75; P10.4 60.58,5.25; P10.5 63.58,5.25; P10.6 63.58,7.75; P10.7 63.58,10.25; P10.8 63.58,12.75; P11.1 66.08,12.75; P11.2 66.08,10.25; P11.3 66.08,7.75; P11.4 66.08,5.25; P11.5 69.08,5.25; P11.6 69.08,7.75; P11.7 69.08,10.25; P11.8 69.08,12.75; P12.1 71.58,12.75; P12.2 71.58,10.25; P12.3 71.58,7.75; P12.4 71.58,5.25; P12.5 74.58,5.25; P12.6 74.58,7.75; P12.7 74.58,10.25; P12.8 74.58,12.75
MEGA-FIT-8 = drill 1.8: P1 24.3,3.81; P2 18.6,3.81; P3 12.9,3.81; P4 7.2,3.81; P5 24.3,9.51; P6 18.6,9.51; P7 12.9,9.51; P8 7.2,9.51 | hole 3: 2.03,9.84; 29.47,9.84
TEN60-S24-P6-VERT = drill 1: P1.1 32.44,13.25; P1.2 32.44,10.75; P1.3 32.44,8.25; P1.4 32.44,5.75; P1.5 35.44,5.75; P1.6 35.44,8.25; P1.7 35.44,10.75; P1.8 35.44,13.25; P2.1 37.94,13.25; P2.2 37.94,10.75; P2.3 37.94,8.25; P2.4 37.94,5.75; P2.5 40.94,5.75; P2.6 40.94,8.25; P2.7 40.94,10.75; P2.8 40.94,13.25; P3.1 43.44,13.25; P3.2 43.44,10.75; P3.3 43.44,8.25; P3.4 43.44,5.75; P3.5 46.44,5.75; P3.6 46.44,8.25; P3.7 46.44,10.75; P3.8 46.44,13.25; P4.1 48.94,13.25; P4.2 48.94,10.75; P4.3 48.94,8.25; P4.4 48.94,5.75; P4.5 51.94,5.75; P4.6 51.94,8.25; P4.7 51.94,10.75; P4.8 51.94,13.25; P5.1 54.44,13.25; P5.2 54.44,10.75; P5.3 54.44,8.25; P5.4 54.44,5.75; P5.5 57.44,5.75; P5.6 57.44,8.25; P5.7 57.44,10.75; P5.8 57.44,13.25; P6.1 59.94,13.25; P6.2 59.94,10.75; P6.3 59.94,8.25; P6.4 59.94,5.75; P6.5 62.94,5.75; P6.6 62.94,8.25; P6.7 62.94,10.75; P6.8 62.94,13.25; S1 9.49,11.74; S2 12.03,11.74; S3 14.57,11.74; S4 17.11,11.74; S5 19.65,11.74; S6 22.19,11.74; S7 24.73,11.74; S8 27.27,11.74; S9 9.49,9.2; S10 12.03,9.2; S11 14.57,9.2; S12 17.11,9.2; S13 19.65,9.2; S14 22.19,9.2; S15 24.73,9.2; S16 27.27,9.2; S17 9.49,6.66; S18 12.03,6.66; S19 14.57,6.66; S20 17.11,6.66; S21 19.65,6.66; S22 22.19,6.66; S23 24.73,6.66; S24 27.27,6.66
R0603 = smd 1 x 1.1: 1 -0.85,0; 2 0.85,0

### Placement (x,y rotation side)
ALTDATA  129.54,11.43 180 top
ALTVIDEO  68.58,6.67 180 top
APPLICATION_  113.03,155.83 270 top
BILGEPUMP  161.29,59.69 0 bottom
CLAWMOTOR  161.29,71.12 0 bottom
CLAWSERVO_1  90.17,167.64 270 bottom
CLAWSERVO_2  77.47,167.64 270 bottom
COMM  71.12,5.08 0 top
JP1  63.5,119.38 0 top
LASER  77.47,143.51 270 bottom
LASER2  64.77,143.51 270 bottom
LEDCAMERA_1  161.29,128.27 0 bottom
LEDCAMERA_2  161.29,116.84 0 bottom
LEDCAMERA_3  161.29,105.41 0 bottom
LEDCAMERA_4  161.29,93.98 0 bottom
LEDCAMERA_5  161.29,82.55 0 bottom
MICRO_  90.58,120.8 270 top
MOTOR_1  24.13,120.65 0 bottom
MOTOR_2  24.13,110.49 0 bottom
MOTOR_3  24.13,100.33 0 bottom
MOTOR_4  24.13,90.17 0 bottom
MOTOR_5  24.13,80.01 0 bottom
MOTOR_6  24.13,69.85 0 bottom
MOTOR_7  24.13,59.69 0 bottom
MOTOR_8  24.13,48.26 0 bottom
MOTORDIST_  29.21,125.73 270 top
PWR_IN  58.42,40.64 270 bottom
PWR_IN1  0,-17.78 0 top  (outside the outline)
PWRCONV_  64.85,97.56 270 top
R1  11.71,55.88 180 bottom
R2  10.16,128.27 180 bottom
STEPPER_1  90.17,143.51 270 bottom
STEPPER_2  104.14,143.51 270 bottom
TURNINGMOTOR  161.29,48.26 0 bottom
VSENSE  104.14,167.64 270 bottom

### Tracks (layer width: path | path; a pad name or v marks a point on that pad's centre or on a via)
+3V3  (via drill 0.6)
  Top 0.406: v80.01,62.23 78.2,62.23 PWRCONV_.P1.8
  Top 1.016: MICRO_.P1.1 111.95,65.12 APPLICATION_.S47
  Bottom 0.406: PWRCONV_.P1.4 62.23,73.49 62.23,104.14 63.5,105.41 68.58,105.41 69.85,106.68 69.85,137.16 70.6,137.91 LASER.C1 | COMM.S11 84.45,13.34 84.45,15.88 82.55,17.78 82.55,60.96 81.28,62.23 v80.01,62.23
  pour Top (isolate 0.178, no thermals): 33.66,65.66 104.27,65.66 104.27,61.59 33.66,61.47
+5V  (via drill 0.6)
  Top 0.406: v80.01,57.15 78.62,57.15 PWRCONV_.P2.8
  Top 1.016: MICRO_.P2.1 108.99,59.62 APPLICATION_.S48
  Bottom 0.406: COMM.S10 81.92,13.46 81.92,15.88 81.28,16.51 81.28,55.88 v80.01,57.15
  pour Top (isolate 0.178, no thermals): 69.6,60.2 104.27,60.07 104.27,56.01 69.72,56.01
+5V_SERVO1  (via drill 0.6)
  Top 0.813: APPLICATION_.S21 108.75,101.18 v108.71,101.22 | v107.32,112.39 107.32,114.93 104.14,118.11 85.72,118.11 82.55,121.29 82.55,156.85 v83.82,158.12
  Bottom 0.813: v108.71,101.22 107.32,102.62 v107.32,112.39 | v83.82,158.12 85.29,158.12 CLAWSERVO_1.C2
+5V_SERVO2  (via drill 0.6)
  Top 0.813: APPLICATION_.S22 v108.71,98.68 | v105.41,112.39 105.41,114.3 104.14,115.57 85.72,115.57 80.64,120.65 80.64,156.85 v78.74,158.75
  Bottom 0.813: v78.74,158.75 73.8,158.75 CLAWSERVO_2.C2 | v108.71,98.68 107.06,98.68 105.41,100.33 v105.41,112.39
+12V  (via drill 0.6)
  Top 0.406: APPLICATION_.P10.8 129.74,45.65 132.08,43.18 132.08,7.62 128.27,3.81 109.22,3.81 101.6,11.43 98.98,11.43 COMM.S16
  Top 1.016: v163.19,86.36 163.19,45.59 160.91,43.18 137.16,43.18 132.08,48.26 126.67,48.26 APPLICATION_.P10.1
  Bottom 1.016: v163.19,86.36 160.02,90.17 157.48,90.17 152.65,95 152.65,97.9 LEDCAMERA_4.C2 LEDCAMERA_3.C2 LEDCAMERA_2.C2 LEDCAMERA_1.C2
  pour Top (isolate 0.178, no thermals): 69.6,54.86 104.77,54.99 111.51,54.99 117.6,49.78 127.13,49.78 127,44.58 117.86,44.58 111.12,50.17 104.39,50.29 69.47,50.42
+24V  (via drill 0.6)
  Top 0.61: v58.42,87.63 71.06,87.63 PWRCONV_.S17
  Bottom 0.61: LASER2.C1 57.9,137.91 57.15,137.16 57.15,88.9 v58.42,87.63
+48V_FILT
  pour Top (isolate 0.178, no thermals): 33.66,54.99 61.72,54.86 69.85,49.02 84.33,49.02 93.98,38.86 127.25,38.61 127.25,33.4 92.84,33.4 82.17,44.96 67.31,44.96 60.33,50.29 33.66,50.29
+48V_M1
  Bottom 2.286: MOTORDIST_.P2.4 32.46,111.05 31.75,111.76 31.75,123.19 30.48,124.46 18.67,124.46 MOTOR_1.C1
  pour Bottom (isolate 0.178): 42.8,107.19 42.93,112.01 33.66,112.01 33.66,107.19
+48V_M2
  Bottom 2.286: MOTORDIST_.P3.4 31.61,105.55 27.94,109.22 27.94,111.76 25.4,114.3 18.67,114.3 MOTOR_2.C1
  pour Bottom (no thermals): 42.8,101.73 42.93,106.55 33.66,106.55 33.66,101.73
+48V_M3
  Bottom 2.286: MOTORDIST_.P4.4 30.76,100.05 26.67,104.14 18.67,104.14 MOTOR_3.C1
  pour Bottom (no thermals): 42.67,96.14 42.8,100.96 33.66,100.96 33.66,96.14
+48V_M4
  Bottom 2.286: MOTORDIST_.P5.4 18.95,94.55 MOTOR_4.C1
  pour Bottom (no thermals): 42.67,90.68 42.8,95.5 33.53,95.5 33.53,90.68
+48V_M5
  Bottom 2.286: MOTORDIST_.P6.5 28.9,86.05 26.67,83.82 18.67,83.82 MOTOR_5.C1
  pour Bottom (no thermals): 42.67,85.09 42.8,89.92 33.15,89.92 33.15,85.09
  pour Bottom: 42.67,85.09 42.8,89.92 33.66,89.92 33.66,85.09
+48V_M6
  Bottom 2.286: MOTORDIST_.P7.4 30.85,81.65 24.13,74.93 19.66,74.93 MOTOR_6.C1
  pour Bottom (no thermals): 42.8,77.85 42.93,82.68 33.78,82.68 33.78,77.85
+48V_M7
  Bottom 2.286: MOTORDIST_.P8.4 31.7,76.15 26.67,71.12 26.67,68.58 22.86,64.77 19.66,64.77 MOTOR_7.C1
  pour Bottom (no thermals): 42.67,72.26 42.8,77.09 33.78,77.09 33.78,72.26
+48V_M8
  Bottom 2.286: MOTORDIST_.P9.4 33.82,70.65 29.21,66.04 29.21,58.42 24.13,53.34 19.66,53.34 MOTOR_8.C1
  pour Bottom (no thermals): 42.8,66.8 42.93,71.63 33.78,71.63 33.78,66.8
+48V_RAW
  pour Top (isolate 0.178, no thermals): 46.99,13.97 60.96,13.97 80.01,33.02 80.01,38.35 70.1,38.35 55.88,24.13 46.99,24.13
AC_COUPLE
  Bottom 0.406: COMM.S12 88.18,12.02 87,13.21 87,15.88 86.36,16.51 85.09,16.51 83.82,17.78 83.82,67.31 82.55,68.58 73.22,68.58 PWRCONV_.S24
BILGE  (via drill 0.6)
  Top 1.016: APPLICATION_.S32 129.07,70.32 v135.89,63.5
  Bottom 1.016: v135.89,63.5 146.55,63.5 BILGEPUMP.C4 BILGEPUMP.C3
BILGEPWM
  Top 0.178: MICRO_.S41 96.74,88.05 97.79,87 103.51,87 104.52,88.01 119.6,88.01 APPLICATION_.S41
CLAW+
  Bottom 1.016: APPLICATION_.P6.8 129.98,116.15 130.81,115.32 130.81,87.63 138.43,80.01 149.86,80.01 152.4,77.47 152.4,75.36 CLAWMOTOR.C2 CLAWMOTOR.C1
  pour Bottom (no thermals): 126.87,115.32 117.98,115.32 117.98,120.02 126.87,120.02
CLAW-
  Bottom 1.016: APPLICATION_.P7.1 127.76,65.15 130.81,68.58 130.81,73.66 132.08,74.93 146.55,74.93 CLAWMOTOR.C4 CLAWMOTOR.C3
  pour Bottom (no thermals): 127,61.34 118.11,61.34 118.11,65.91 127,65.91
CLAWCURRENT
  Bottom 0.178: MICRO_.S40 99.28,70.45 100.19,71.39 121.17,71.39 APPLICATION_.S40
CLAWPWM1
  Bottom 0.178: APPLICATION_.S26 124.29,85.56 123.19,84.45 102.89,84.45 MICRO_.S26
CLAWPWM2
  Bottom 0.178: APPLICATION_.S25 123.91,88.1 122.92,87.02 102.75,87.02 MICRO_.S25
COM_A
  Top 0.406: ALTDATA.C1 123.94,17.03 120.65,20.32 92.71,20.32 91.44,19.05 91.44,15.23 COMM.S21
COM_B
  Top 0.406: ALTDATA.C2 120.94,17.49 119.38,19.05 95.25,19.05 93.98,17.78 93.98,15.23 COMM.S22
COM_Y
  Top 0.406: ALTDATA.C4 114.94,15.87 114.3,16.51 100.33,16.51 99.06,15.24 99.06,15.23 COMM.S24
COM_Z
  Top 0.406: ALTDATA.C3 117.94,16.68 116.84,17.78 97.79,17.78 96.52,16.51 96.52,15.23 COMM.S23
EXTGND  (via drill 0.38)
  Top 0.178: APPLICATION_.S20 119.69,103.82 120.67,104.8 129.56,104.8 | 131.44,159.38 128.9,161.93 v109.22,161.93
  Top 0.203: 129.56,104.8 131.44,106.68 131.44,159.38
  Bottom 0.178: v109.22,161.93 100.3,161.93
  Bottom 0.254: 100.3,161.93 VSENSE.C1
FUSEDETECTM
  Top 0.254: MOTORDIST_.P1.8 42.48,113.03 45.08,113.03 46.36,111.76 46.36,95.25 48.07,93.53 MICRO_.S24
  pour Top (isolate 0.178, no thermals): 42.93,112.78 43.05,117.6 33.66,117.6 33.66,112.78
FUSEDETECTP
  Top 0.254: PWRCONV_.S16 75.76,68.58 85.72,68.58 87,69.85 87,89.54 88.9,91.44 97.15,91.44 99.25,93.53 MICRO_.S16
GND  (via drill 0.6)
  Bottom 0.406: COMM.S13 89.54,10.78 89.54,7.3 88.9,6.67 88.58,6.67
  other vias: 60.01,6.03 71.12,2.22 87.95,1.91 34.61,22.86 20.32,39.37 58.1,43.18 103.51,27.94 137.48,25.4 150.18,38.42 142.56,39.37 121.92,28.89 110.17,44.77 155.26,66.99 138.11,91.44 54.29,83.19 55.25,100.01 52.07,114.93 54.61,139.38 41.91,149.86 56.52,160.02 74.61,117.16 96.84,147.32 145.1,137.8 140.02,153.04 167.64,125.1
  pour Top (isolate 0.508, rank 6, no thermals): 0,126.36 46.36,172.72 126.36,172.72 172.72,126.36 172.72,46.36 126.36,0 46.36,0 0,46.36
  pour Bottom (isolate 0.508, rank 6, no thermals): 0,46.36 0,126.36 46.36,172.72 126.36,172.72 172.72,126.36 172.72,46.36 126.36,0 46.36,0
LASER1  (via drill 0.25)
  Top 0.254: MICRO_.S9 99.28,112.5 97.79,113.98 68.58,113.98 67.31,115.25 67.31,133.99 v66.67,134.62
  Bottom 0.254: v66.67,134.62 61.11,134.62 LASER2.C2
LASER2  (via drill 0.25)
  Top 0.254: v66.04,128.27 66.04,114.3 67.31,113.03 96.84,113.03 97.92,112.08 97.92,110.26 MICRO_.S10
  Bottom 0.254: LASER2.C4 65.4,128.91 v66.04,128.27
LASER3
  Top 0.254: JP1.1 63.5,113.03 64.77,111.76 96.29,111.76 MICRO_.S17
LASER_RX
  Bottom 0.254: MICRO_.S22 96.55,98.42 85.09,98.42 80.64,102.87 80.64,131.44 80.18,131.91 LASER.C3
LASER_TX
  Bottom 0.254: MICRO_.S23 96.55,95.89 85.72,95.89 79.38,102.23 79.38,128.27 78.73,128.91 LASER.C4
LEDLOOP
  Bottom 1.016: LEDCAMERA_5.C3 LEDCAMERA_5.C2
LEDPWM1
  Bottom 0.178: MICRO_.S27 102.17,82.99 103.25,81.92 123.67,81.92 APPLICATION_.S27
LEDPWM2
  Bottom 0.178: APPLICATION_.S28 124.67,80.48 123.57,79.38 102.89,79.38 MICRO_.S28
LEDPWM3
  Bottom 0.178: APPLICATION_.S29 124.77,78.43 124.2,79.02 103.02,79.02 MICRO_.S29
LEDPWM4
  Bottom 0.178: MICRO_.S30 117.54,75.37 118.64,76.47 123.48,76.47 APPLICATION_.S30
LEDPWM5
  Bottom 0.178: MICRO_.S31 103.06,72.83 104.14,71.75 123.67,71.75 APPLICATION_.S31
LEDPWR1
  Bottom 1.016: APPLICATION_.P1.8 147.18,143.65 149.86,140.97 149.86,132.39 LEDCAMERA_1.C3
  pour Bottom (no thermals): 127,142.88 118.11,142.88 118.11,147.57 127,147.57
LEDPWR2
  Bottom 1.016: APPLICATION_.P2.8 128.55,138.15 142.24,124.46 147.32,124.46 149.86,121.92 149.86,120.96 LEDCAMERA_2.C3
  pour Bottom (no thermals): 127,137.41 118.11,137.41 118.11,141.99 127,141.99
LEDPWR3
  Bottom 1.016: LEDCAMERA_3.C3 149.69,110.66 147.32,113.03 139.7,113.03 138.43,114.3 138.43,124.46 130.05,132.84 126.85,132.84 APPLICATION_.P3.8
  pour Bottom (no thermals): 127,131.95 118.11,131.95 118.11,136.4 127,136.4
LEDPWR4
  Bottom 1.016: APPLICATION_.P4.8 132.82,127.15 135.89,124.08 135.89,102.87 137.16,101.6 147.32,101.6 149.86,99.06 149.86,98.11 LEDCAMERA_4.C3
  pour Bottom (no thermals): 127,126.36 118.11,126.36 118.11,130.94 127,130.94
LEDPWR5
  Bottom 1.016: APPLICATION_.P5.8 131.97,121.65 133.35,120.14 133.35,88.9 135.89,86.36 146.55,86.36 LEDCAMERA_5.C4
  pour Bottom (no thermals): 127,120.9 118.11,120.9 118.11,125.48 127,125.48
MCOM+  (via drill 0.6)
  Top 0.254: MICRO_.S19 96.55,106.05 50.17,106.05 48.89,107.32 48.89,122.55 41.91,129.54 v14.6,129.54
  Bottom 0.254: v14.6,129.54 12.28,129.54 R2.2
  Bottom 0.406: 12.56,53.41 arc45 MOTOR_8.C3 12.53,53.17 12.7,53.34 12.7,55.74 R1.2 12.56,63.62 MOTOR_7.C3 MOTOR_6.C3 MOTOR_5.C3 MOTOR_4.C3 MOTOR_3.C3 MOTOR_2.C3 MOTOR_1.C3 11.01,126.12 R2.2
MCOM-  (via drill 0.6)
  Top 0.254: MICRO_.S18 95.28,107.32 50.8,107.32 50.17,107.95 50.17,123.19 42.55,130.81 v10.8,130.81
  Bottom 0.254: v10.8,130.81 9.31,129.32 R2.1
  Bottom 0.406: MOTOR_8.C4 10.86,53.54 R1.1 9.53,57.21 MOTOR_7.C4 MOTOR_6.C4 MOTOR_5.C4 MOTOR_4.C4 MOTOR_3.C4 MOTOR_2.C4 MOTOR_1.C4 9.53,128.27 R2.1
N$1  (via drill 1.6)
  other vias: 26.36,127.36
N$2  (via drill 1.6)
  other vias: 52.36,127.36
N$3  (via drill 1.6)
  other vias: 24.36,43.36
N$4  (via drill 1.6)
  other vias: 51.36,43.36
N$5  (via drill 1.6)
  other vias: 109.36,125.36
N$6  (via drill 1.6)
  other vias: 87.36,121.36
N$7  (via drill 1.6)
  other vias: 66.36,101.36
N$8  (via drill 1.6)
  other vias: 77.36,101.36
N$9  (via drill 1.6)
  other vias: 78.36,23.36
N$10  (via drill 1.6)
  other vias: 61.36,34.36
N$11  (via drill 1.6)
  other vias: 106.36,30.36
N$12  (via drill 1.6)
  other vias: 87.36,31.36
N$13  (via drill 1.6)
  other vias: 114.36,23.36
N$14  (via drill 1.6)
  other vias: 128.36,23.36
N$15  (via drill 1.6)
  other vias: 112.36,165.36
N$16  (via drill 1.6)
  other vias: 129.36,165.36
S1
  Top 0.178: MICRO_.S1 101.82,111.29 102.87,110.24 123.67,110.24 APPLICATION_.S1
S2
  Top 0.178: MICRO_.S2 102.05,108.77 103.13,107.7 123.67,107.7
  Top 0.203: 123.67,107.7 APPLICATION_.S2
S3
  Top 0.178: MICRO_.S3 101.82,106.21 102.87,105.16 123.67,105.16 APPLICATION_.S3
S4
  Top 0.178: MICRO_.S4 101.82,103.67 102.87,102.62
  Top 0.203: 102.87,102.62 123.67,102.62 APPLICATION_.S4
S5
  Top 0.178: MICRO_.S5 101.82,101.13 102.87,100.08 123.67,100.08 APPLICATION_.S5
SERVO1CURRENT
  Bottom 0.178: MICRO_.S36 99.5,80.45 100.54,81.55 121.13,81.55 APPLICATION_.S36
SERVO1PWM
  Bottom 0.254: MICRO_.S20 96.55,103.51 85.09,103.51 83.19,105.41 83.19,154.94 84.92,156.04 CLAWSERVO_1.C3
SERVO2CURRENT
  Bottom 0.178: 122.21,83.02 121.03,84.1 100.48,84.1 MICRO_.S35
  Bottom 0.203: APPLICATION_.S35 122.21,83.02
SERVO2PWM
  Bottom 0.254: MICRO_.S21 96.55,100.96 85.09,100.96 81.92,104.14 81.92,153.67 79.55,156.04 CLAWSERVO_2.C3
STEP1
  Bottom 0.178: APPLICATION_.S33 122.23,88.72 121.8,89.23 100.37,89.23 MICRO_.S33
STEP1A1
  Bottom 0.254: APPLICATION_.S13 121.16,102.35 118.09,102.35 114.3,106.05 114.3,118.74 111.12,121.92 97.79,121.92 96.52,123.19 96.52,136.52 95.14,137.91 STEPPER_1.C1
STEP1A2
  Bottom 0.254: APPLICATION_.S14 121.16,99.75 118.1,99.75 113.67,104.14 113.67,118.11 110.49,121.29 97.15,121.29 95.89,122.55 95.89,133.99 94.96,134.91 STEPPER_1.C2
STEP1B1
  Bottom 0.254: APPLICATION_.S15 121.17,97.22 118.11,97.22 113.03,102.23 113.03,117.48 109.86,120.65 96.52,120.65 95.25,121.92 95.25,131.44 94.79,131.91 STEPPER_1.C3
STEP1B2
  Bottom 0.254: APPLICATION_.S16 121.17,94.67 118.1,94.67 112.39,100.33 112.39,116.84 109.22,120.02 95.89,120.02 94.61,121.29 94.61,128.27 93.98,128.91 STEPPER_1.C4
STEP2
  Top 0.178: MICRO_.S43 96.74,82.97 97.92,81.79 103.12,81.79 104.39,83.06 119.65,83.06 APPLICATION_.S43
STEP2A1
  Bottom 0.254: APPLICATION_.S9 122.23,111.45 120.65,113.03 118.11,113.03 116.84,114.3 116.84,135.89 114.82,137.91 STEPPER_2.C1
STEP2A2
  Bottom 0.254: APPLICATION_.S10 121.16,109.94 118.1,109.94 116.2,111.76 116.2,133.35 114.64,134.91 STEPPER_2.C2
STEP2B1
  Bottom 0.254: APPLICATION_.S11 121.14,107.47 118.08,107.47 115.57,109.86 115.57,130.81 114.47,131.91 STEPPER_2.C3
STEP2B2
  Bottom 0.178: 121.16,104.77 121.03,104.9
  Bottom 0.254: APPLICATION_.S12 121.17,104.77 121.16,104.77 | 121.03,104.9 118.11,104.9 114.93,108.08 114.93,127 113.02,128.91 STEPPER_2.C4
STEPDIR1
  Top 0.178: MICRO_.S44 97.22,80.45 98.42,79.25 102.74,79.25 104.01,80.52 119.65,80.52
  Top 0.203: 119.65,80.52 APPLICATION_.S44
STEPDIR2
  Top 0.178: MICRO_.S42 96.74,85.38 97.79,84.33 103.38,84.33 104.65,85.6 119.65,85.6 APPLICATION_.S42
STEPEN
  Bottom 0.178: APPLICATION_.S34 121.83,85.56 120.76,86.65 100.35,86.65 MICRO_.S34
TETHER_RX  (via drill 0.6)
  Top 0.406: v91.44,25.4 90.17,24.13 88.9,24.13 83.82,19.05 83.82,15.23 COMM.S18
  Bottom 0.406: MICRO_.S46 95.69,75.37 91.44,71.12 v91.44,25.4
TETHER_TX  (via drill 0.6)
  Top 0.406: v90.17,26.67 88.9,25.4 87.63,25.4 81.28,19.05 81.28,15.23 COMM.S17
  Bottom 0.406: MICRO_.S45 95.69,77.91 90.17,72.39 v90.17,26.67
TURN+
  Bottom 1.016: APPLICATION_.P8.8 138.8,56.65 139.7,55.88 151.13,55.88 152.4,54.61 152.4,52.5 TURNINGMOTOR.C2 TURNINGMOTOR.C1
  pour Bottom (no thermals): 127,55.88 118.11,55.88 118.11,60.58 127,60.58
TURN-
  Bottom 1.016: APPLICATION_.P9.8 140.05,51.15 140.97,52.07 146.55,52.07 TURNINGMOTOR.C4 TURNINGMOTOR.C3
  pour Bottom (no thermals): 127,50.42 118.11,50.42 118.11,54.99 127,54.99
TURNCURRENT
  Bottom 0.178: MICRO_.S37 100.48,76.83 121.67,76.83 122.23,77.4 APPLICATION_.S37
TURNPWM1
  Bottom 0.178: MICRO_.S39 99.5,72.83 100.59,73.93 120.8,73.93 APPLICATION_.S39
TURNPWM2
  Bottom 0.178: MICRO_.S38 99.89,75.37 100.84,74.3 121.25,74.3 122.23,75.27 APPLICATION_.S38
VIDEO1  (via drill 0.51, 0.6)
  Top 0.406: v148.59,125.73 157.48,125.73 168.91,114.3 v168.91,44.45
  Bottom 0.406: LEDCAMERA_1.C4 146.69,127.63 v148.59,125.73 | COMM.S5 90.77,7.02 96.52,1.27 125.73,1.27 v168.91,44.45
VIDEO2  (via drill 0.51, 0.6)
  Top 0.406: v148.59,114.3 166.37,114.3 167.64,113.03 v167.64,44.45
  Bottom 0.406: LEDCAMERA_2.C4 146.69,116.2 v148.59,114.3 | COMM.S6 93.31,7.02 97.79,2.54 125.73,2.54 v167.64,44.45
VIDEO3  (via drill 0.51, 0.6)
  Top 0.406: v148.59,102.87 165.1,102.87 166.37,100.33 v166.37,44.45
  Bottom 0.406: LEDCAMERA_3.C4 146.69,104.77 v148.59,102.87 | COMM.S7 95.85,7.02 99.06,3.81 125.73,3.81 v166.37,44.45
VIDEO4  (via drill 0.51 pad 0.25, 0.6)
  Top 0.406: v148.59,91.44 162.56,91.44 165.1,88.9 v165.1,44.45
  Bottom 0.406: LEDCAMERA_4.C4 146.69,93.34 v148.59,91.44 | COMM.S8 98.39,7.02 100.33,5.08 125.73,5.08 v165.1,44.45
VOUT1
  Top 0.406: ALTVIDEO.C1 62.98,8.05 63.5,8.57 78.42,8.57 79.38,7.62 87,7.62 87.63,8.26 87.63,8.88 COMM.S4
VOUT2
  Top 0.406: ALTVIDEO.C3 56.98,9.35 58.42,10.8 84.38,10.8 COMM.S3
VPROBE1  (via drill 0.38)
  Top 0.178: 120.68,107.33 128.91,107.33 | 128.27,158.75 v109.22,158.75
  Top 0.203: APPLICATION_.S19 119.69,106.36 120.68,107.33 | 128.91,107.33 130.81,109.22 130.81,156.21 128.27,158.75
  Bottom 0.178: v109.22,158.75 100.48,158.75
  Bottom 0.254: 100.48,158.75 VSENSE.C2
VPROBE2  (via drill 0.38)
  Top 0.178: APPLICATION_.S18 119.69,108.89 120.65,109.88 128.27,109.88 | 127.64,156.21 v109.22,156.21
  Top 0.203: 128.27,109.88 130.18,111.76 130.18,153.67 127.64,156.21
  Bottom 0.178: v109.22,156.21 100.36,156.21
  Bottom 0.254: 100.36,156.21 VSENSE.C3
VPROBE3  (via drill 0.38)
  Top 0.178: APPLICATION_.S17 119.69,111.43 121.29,113.03 128.27,113.03 | 127,153.04 v109.22,153.04
  Top 0.203: 128.27,113.03 129.54,114.3 129.54,150.5 127,153.04
  Bottom 0.178: v109.22,153.04 VSENSE.C4
  Bottom 0.254: VSENSE.C4
VSEL1  (via drill 0.6)
  Top 0.406: v92.71,24.13 91.44,22.86 90.17,22.86 86.36,19.05 86.36,15.23 COMM.S19
  Bottom 0.406: MICRO_.S47 95.69,72.83 92.71,69.85 v92.71,24.13
VSEL2  (via drill 0.6)
  Top 0.406: COMM.S20 88.23,18.38 91.44,21.59 92.71,21.59 v93.98,22.86
  Bottom 0.406: MICRO_.S48 95.69,70.29 93.98,68.58 v93.98,22.86
VSEN1
  Top 0.178: MICRO_.S8 101.82,93.13 102.87,92.08 123.29,92.08 APPLICATION_.S8
VSEN2
  Top 0.178: MICRO_.S7 102.05,96.07 103.12,95 123.67,95 APPLICATION_.S7
VSEN3
  Top 0.178: MICRO_.S6 101.92,98.61 103,97.54 123.67,97.54
  Top 0.203: 123.67,97.54 APPLICATION_.S6

### Text on the board
tNames: Designed by Nick Molo / Purdue IEEE ROV 2015 / X7 - BackPlane | MICROCONTROLLER | MOTOR DISTRIBUTION | POWER CONVERSION | APPLICATION | COMMUNICATIONS
bNames: POWER